# EAGLE schematic Schematic v19 (EAGLE 9.7.0)
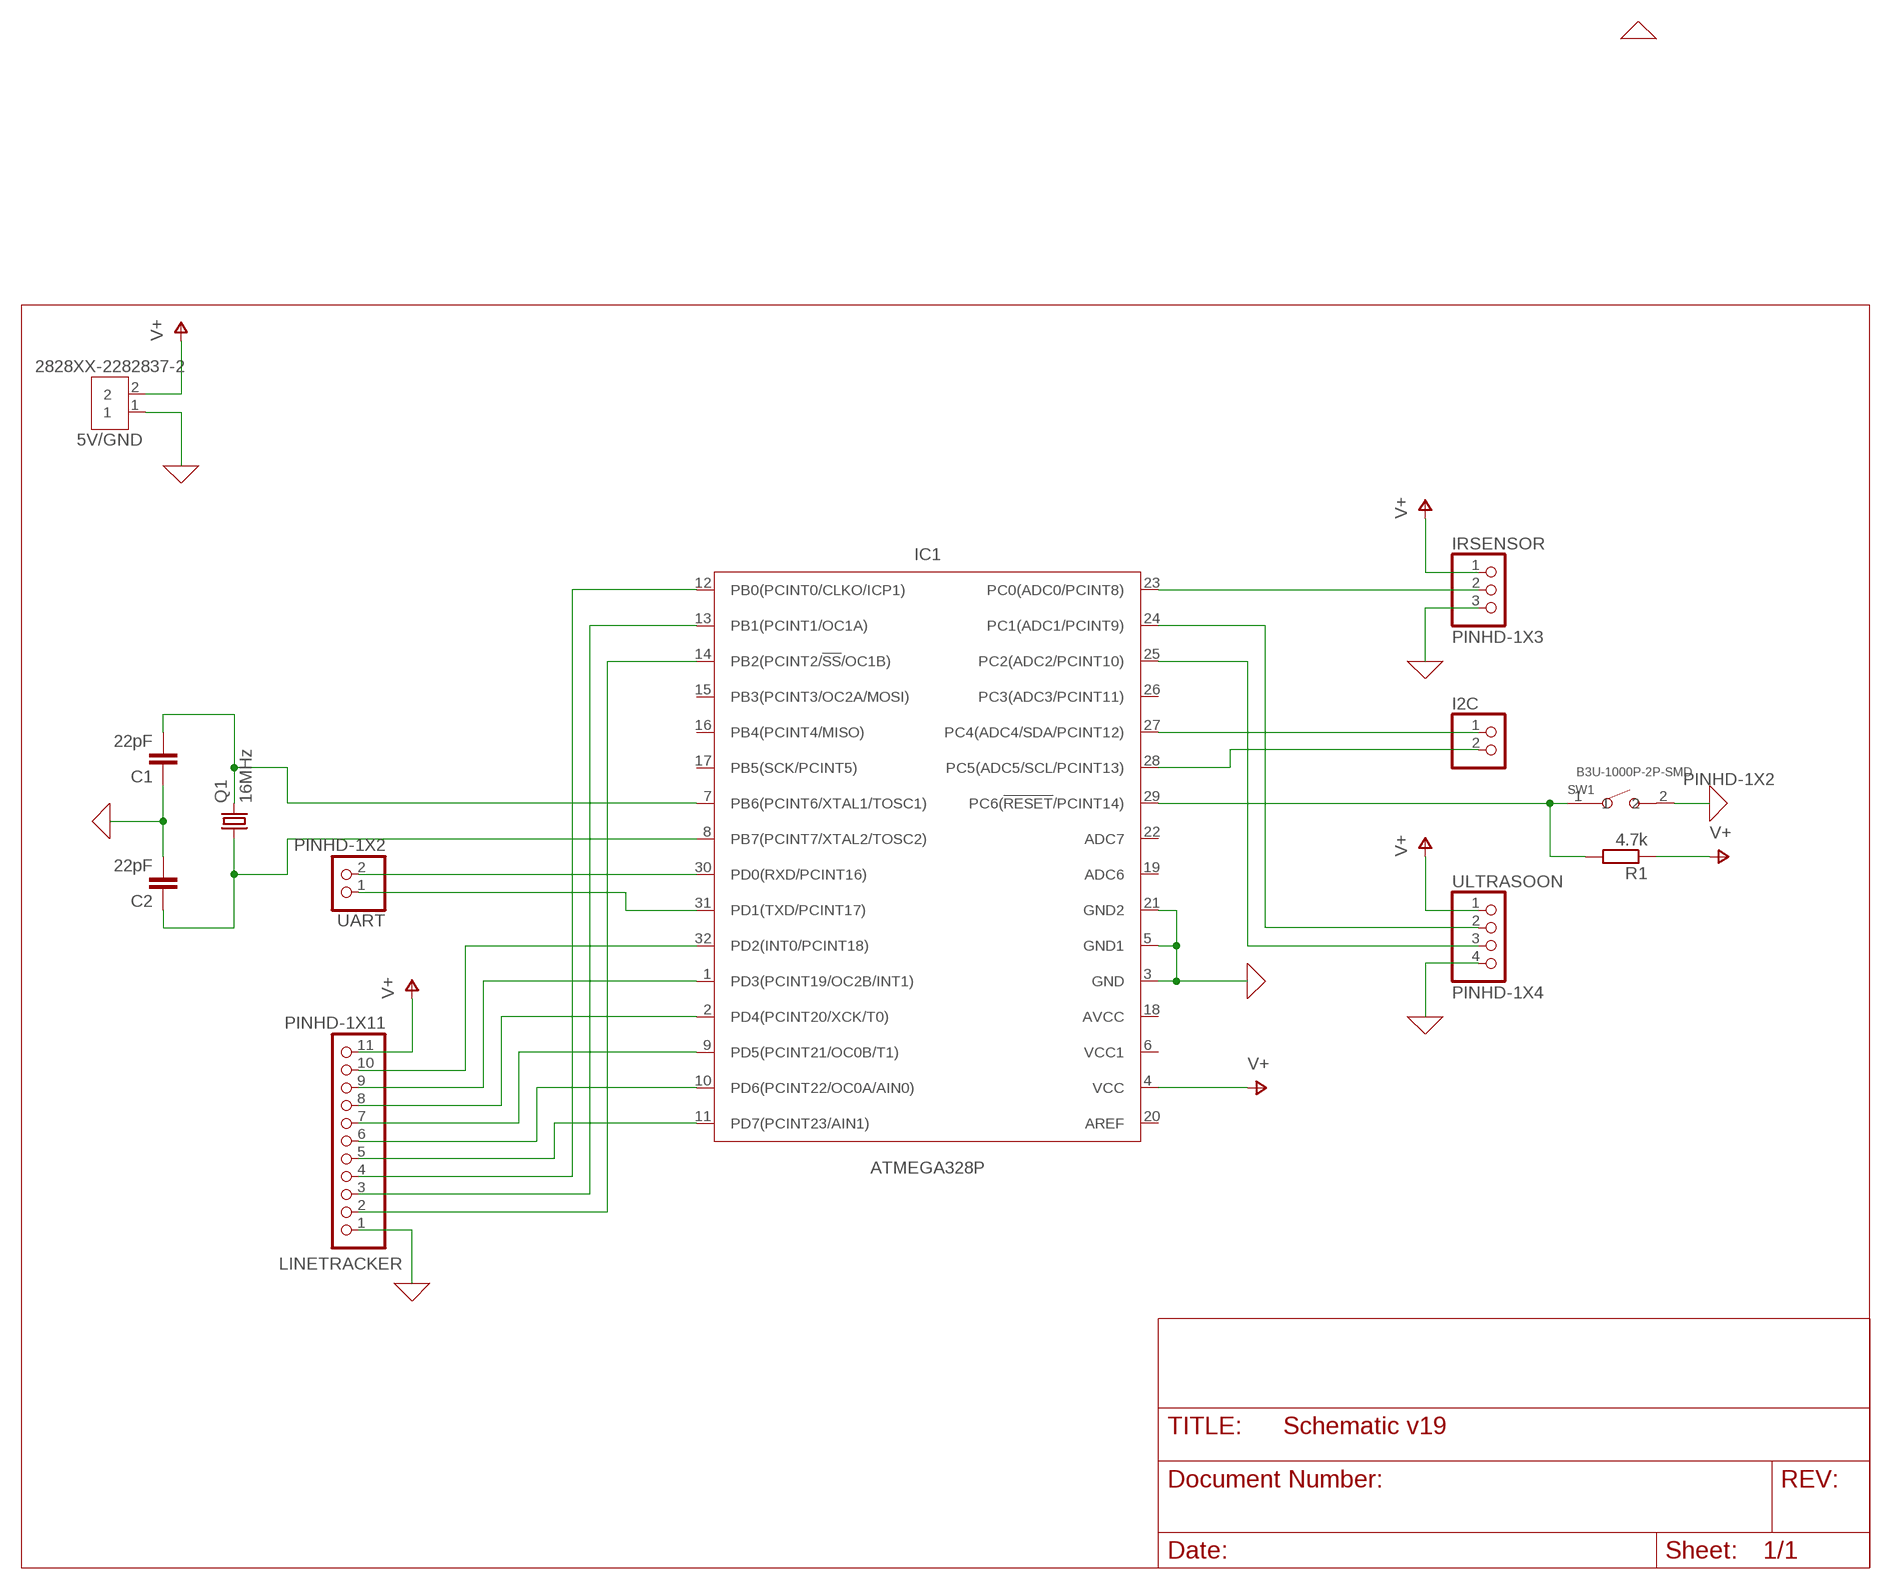
[diagram p0: schematic, sheet 1]

## Parts
5V/GND  2828XX-2282837-2  [TERMBLK_508-2N]
C1  22pF  C-EUC0805  [C0805]
C2  22pF  C-EUC0805  [C0805]
I2C  PINHD-1X2  [1X02]
IC1  ATMEGA328P  ATMEGA328P_TQFP  [TQFP32-08]
IRSENSOR  PINHD-1X3  [1X03]
LINETRACKER  PINHD-1X11  [1X11]
Q1  16MHz  CRYSTALSM49  [SM49]
R1  4.7k  R-EU_R0805  [R0805]
SW1  B3U-1000P-2P-SMD  SMD-BUTTON(2P-3.0X2.5X1.2+0.4MM)-B3U-1000P-2P-SMD  [SW2-2.6-3.0X2.5X1.2+0.4MM]
UART  PINHD-1X2  [1X02]
ULTRASOON  PINHD-1X4  [1X04]

## Nets
0: 5V/GND.1 C1.1 C2.2 IC1.3(GND) IC1.5(GND1) IC1.21(GND2) IRSENSOR.3 LINETRACKER.1 SW1.2 ULTRASOON.4 ; supply symbol labelled GND
N$1: C2.1 IC1.8(PB7(PCINT7/XTAL2/TOSC2)) Q1.1
N$2: C1.2 IC1.7(PB6(PCINT6/XTAL1/TOSC1)) Q1.2
N$3: IC1.29(PC6(!RESET!/PCINT14)) R1.2 SW1.1
N$4: IC1.32(PD2(INT0/PCINT18)) LINETRACKER.10
N$5: IC1.2(PD4(PCINT20/XCK/T0)) LINETRACKER.8
N$6: IC1.9(PD5(PCINT21/OC0B/T1)) LINETRACKER.7
N$7: IC1.10(PD6(PCINT22/OC0A/AIN0)) LINETRACKER.6
N$8: IC1.11(PD7(PCINT23/AIN1)) LINETRACKER.5
N$9: IC1.24(PC1(ADC1/PCINT9)) ULTRASOON.2
N$10: IC1.12(PB0(PCINT0/CLKO/ICP1)) LINETRACKER.4
N$11: IC1.13(PB1(PCINT1/OC1A)) LINETRACKER.3
N$12: IC1.25(PC2(ADC2/PCINT10)) ULTRASOON.3
N$14: IC1.23(PC0(ADC0/PCINT8)) IRSENSOR.2
N$15: IC1.1(PD3(PCINT19/OC2B/INT1)) LINETRACKER.9
N$16: IC1.30(PD0(RXD/PCINT16)) UART.2
N$17: IC1.31(PD1(TXD/PCINT17)) UART.1
N$18: I2C.1 IC1.27(PC4(ADC4/SDA/PCINT12))
N$19: I2C.2 IC1.28(PC5(ADC5/SCL/PCINT13))
N$20: IC1.14(PB2(PCINT2/!SS!/OC1B)) LINETRACKER.2
V+: 5V/GND.2 IC1.4(VCC) IRSENSOR.1 LINETRACKER.11 R1.1 ULTRASOON.1
Unconnected: IC1.15(PB3(PCINT3/OC2A/MOSI)) IC1.16(PB4(PCINT4/MISO)) IC1.17(PB5(SCK/PCINT5)) IC1.19(ADC6) IC1.22(ADC7) IC1.26(PC3(ADC3/PCINT11))

## Power pins joined to a net without a drawn wire
AREF: IC1.20(AREF)
AVCC: IC1.18(AVCC)
VCC1: IC1.6(VCC1)

## Library data of the parts
5V/GND = Connector:2828XX-2: 2 Position Wire to Board Terminal Block Horizontal with Board Datasheet <https://www.te.com.cn/commerce/DocumentDelivery/DDEController?Action=showdoc&DocId=Catalog+Section%7F1308389_EUROSTYLE_TERMINAL_BLOCKS%7F0607%7Fpdf%7FEnglish%7FENG_CS_1308389_EUROSTYLE_TERMINAL_BLOCKS_0607.pdf%7F2-282837-5>; CATEGORY: Connector; DESCRIPTION: 2 Position Wire to Board Terminal Block Horizontal with Board 5.08 mm Through Hole; MANUFACTURER: TE Connectivity; MPN: 282837-2; OPERATING_TEMPERATURE: -40°C to +105°C; PART_STATUS: ACTIVE; ROHS_COMPLIANCE: RoHS Compliant; SERIES: 282837; SUBCATEGORY: Terminal Block; TYPE: Side Wire Entry
C1 C2 = rcl:C-EU: CAPACITOR, European symbol; SPICEPREFIX: C
I2C UART = Connector:PINHD-1X2: PIN HEADER; CATEGORY: CONNECTOR; SUB-CATEGORY: PIN-HEADER
IC1 = IC_Embedded:ATMEGA328P: 8-bit AVR Microcontroller with 32K Bytes In-System Programmable Flash Datasheet <http://ww1.microchip.com/downloads/en/DeviceDoc/Atmel-7810-Automotive-Microcontrollers-ATmega328P_Datasheet.pdf>; CATEGORY: IC_Embedded; MANUFACTURER: Microchip; MPN: ATmega328P-MMH; OPERATING_TEMP: -40 to 85 °C; PART_STATUS: Active; SUB-CATEGORY: Microcontroller
IRSENSOR = Connector:PINHD-1X3: PIN HEADER; CATEGORY: CONNECTOR; SUB-CATEGORY: PIN-HEADER
LINETRACKER = Connector:PINHD-1X11: PIN HEADER; CATEGORY: CONNECTOR; SUB-CATEGORY: PIN-HEADER
Q1 = crystal:CRYSTAL: CRYSTAL; OC_FARNELL: unknown; OC_NEWARK: unknown
R1 = rcl:R-EU_: RESISTOR, European symbol; SPICEPREFIX: R
SW1 = One_Dimensional_Pong:SMD-BUTTON(2P-3.0X2.5X1.2+0.4MM): 311020047; MPN: B3U-1000P-2P-SMD
ULTRASOON = Connector:PINHD-1X4: PIN HEADER; CATEGORY: CONNECTOR; SUB-CATEGORY: PIN-HEADER